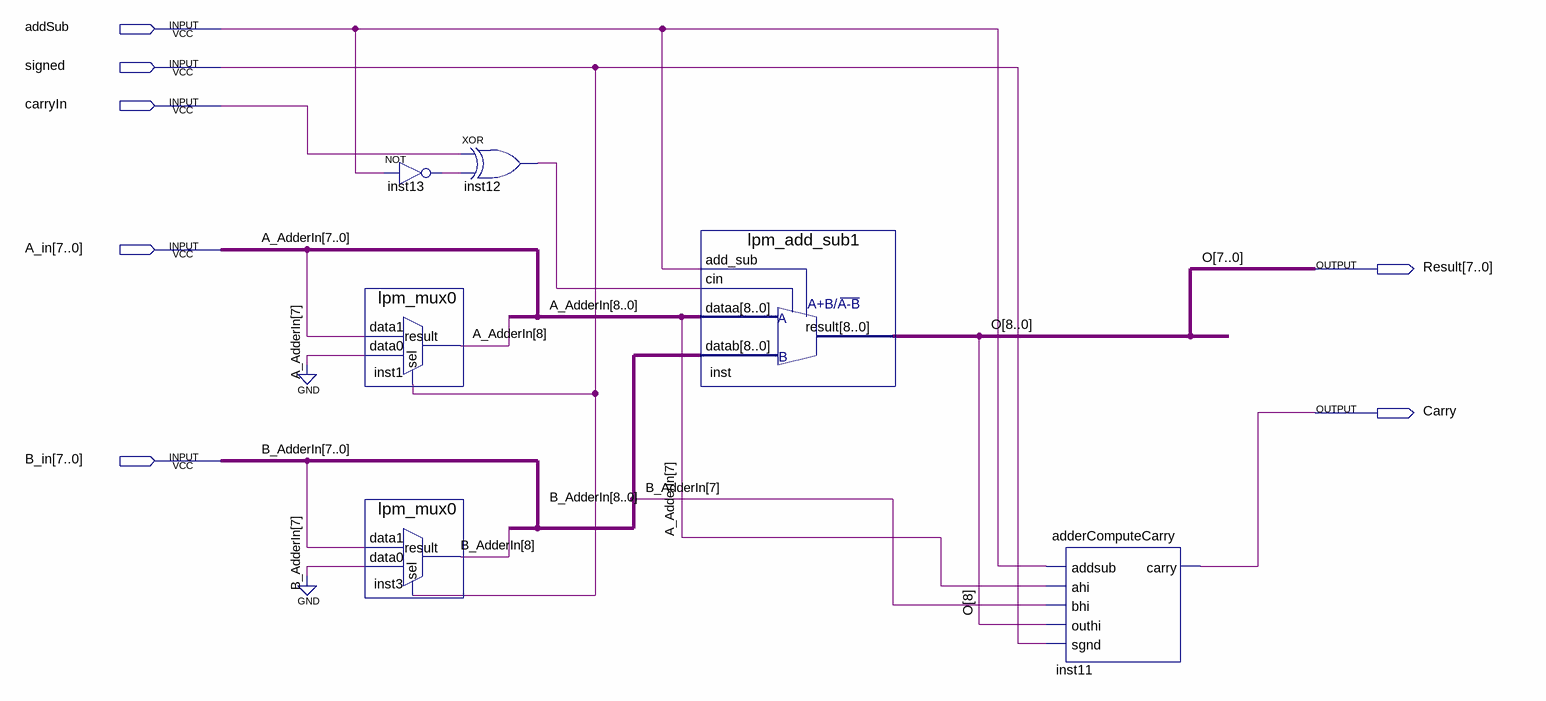
[diagram p0: schematic sheet]
// Quartus schematic pipeline.bdf as structural Verilog: 6 symbols, 7 pins
module pipeline (
  input  addSub,
  input  \signed ,
  input  carryIn,
  input  [7:0] A_in,
  input  [7:0] B_in,
  output [7:0] Result,
  output Carry
);

  wire inst12_out, inst13_out;
  wire [8:8] A_AdderIn, B_AdderIn, O;

  not inst13 (inst13_out, addSub);
  lpm_mux0 inst1 (.data1(A_in[7]), .data0(1'b0), .sel(\signed ), .result(A_AdderIn[8]));
  lpm_mux0 inst3 (.data1(B_in[7]), .data0(1'b0), .sel(\signed ), .result(B_AdderIn[8]));
  xor inst12 (inst12_out, carryIn, inst13_out);
  lpm_add_sub1 inst (
    .cin(inst12_out), .add_sub(addSub), .dataa({A_AdderIn[8], A_in}), .datab({B_AdderIn[8], B_in}),
    .result({O[8], Result}));
  adderComputeCarry inst11 (
    .addsub(addSub), .ahi(A_in[7]), .bhi(B_in[7]), .outhi(O[8]), .sgnd(\signed ), .carry(Carry));

  // Other names for the same wires on the sheet: A_AdderIn[7:0] = A_in; B_AdderIn[7:0] = B_in; O[7:0] = Result
endmodule
